# Altium schematic sheet Feedback_Sensors.SchDoc
size A2; SheetNumber: 7; SheetTotal: 16
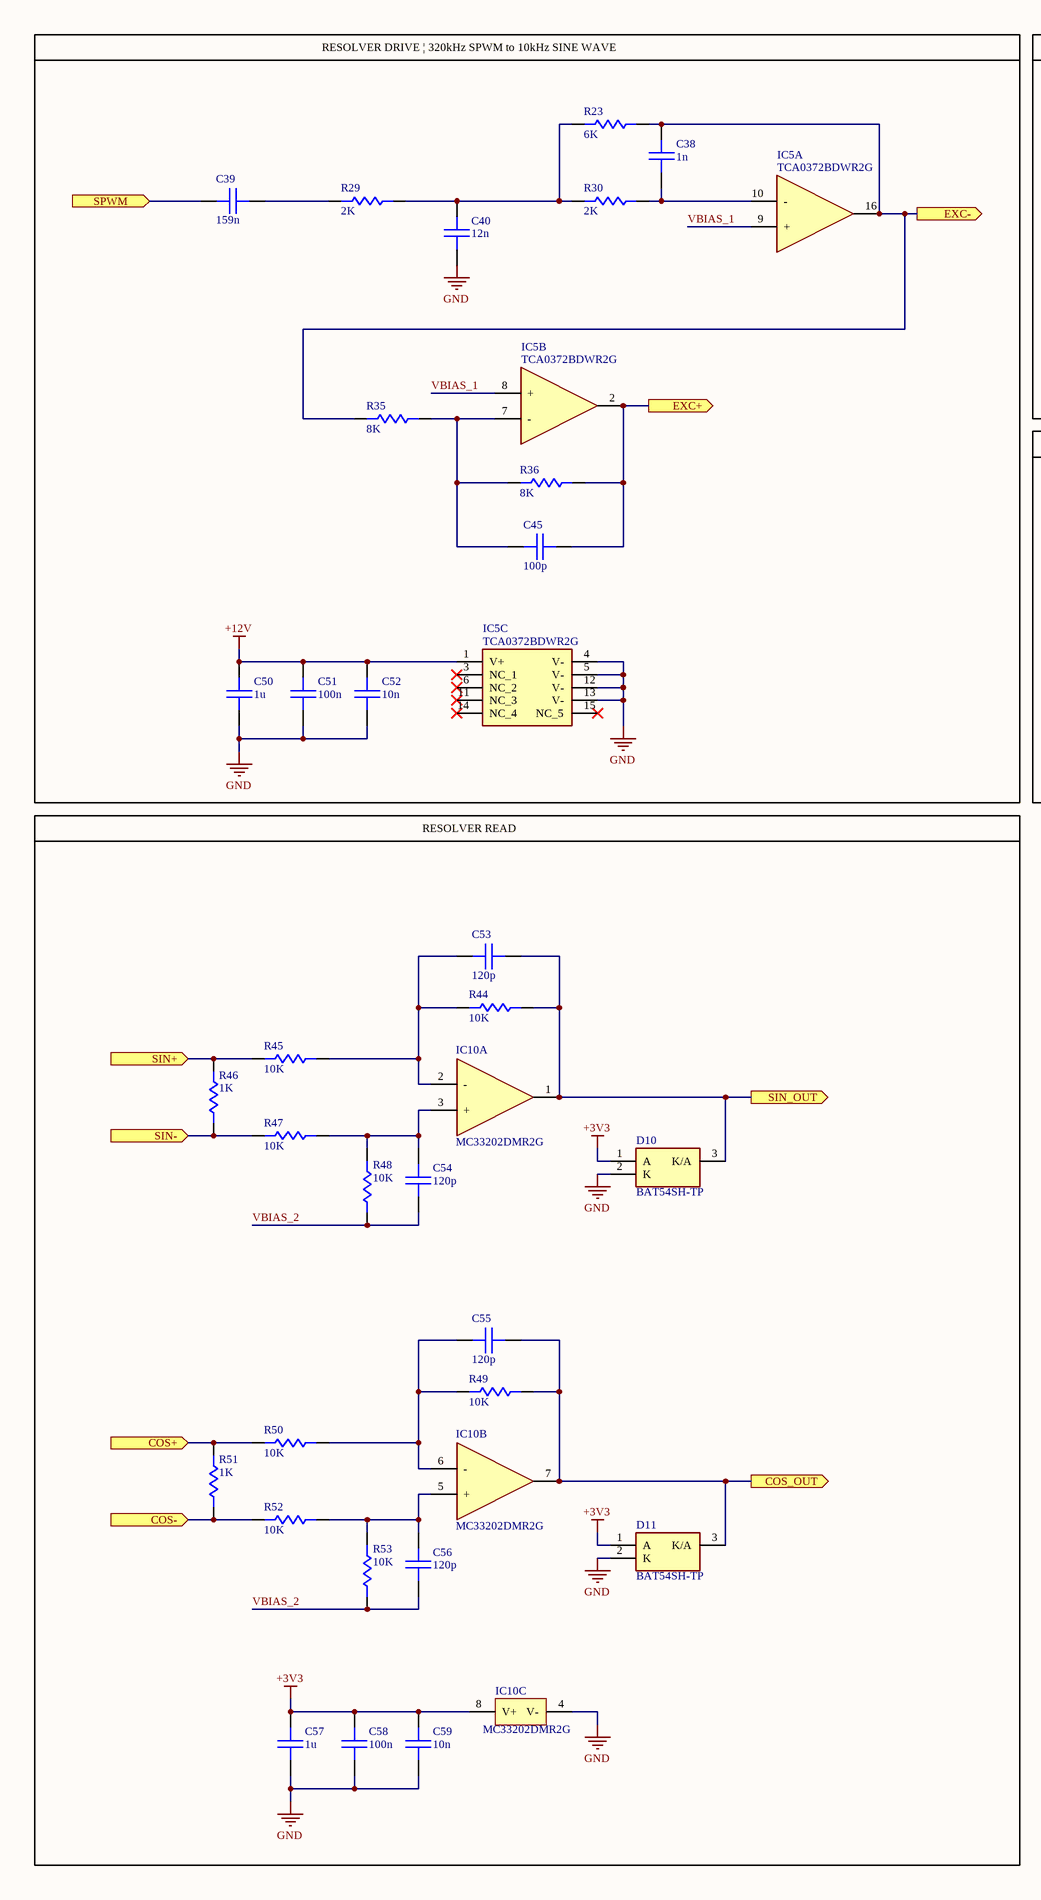
[diagram p0: Feedback_Sensors.SchDoc, left]
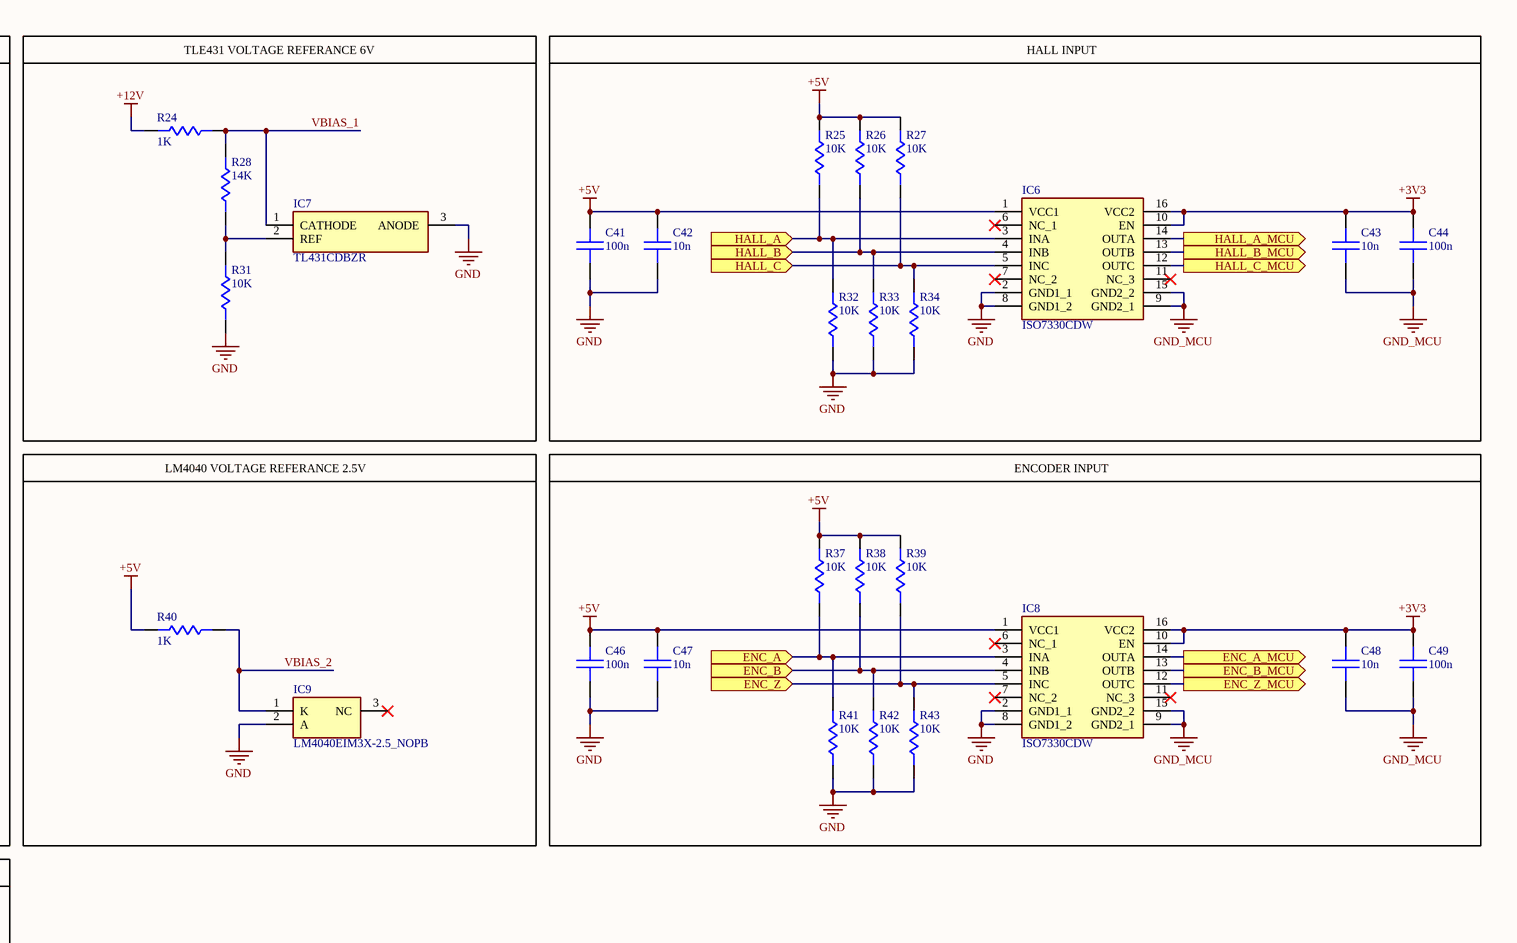
[diagram p1: Feedback_Sensors.SchDoc, right]

## Parts
C38  1n  [C_0603]
C39  159n  [C_0603]
C40  12n  [C_0603]
C41  100n  [C_0603]
C42  10n  [C_0603]
C43  10n  [C_0603]
C44  100n  [C_0603]
C45  100p  [C_0603]
C46  100n  [C_0603]
C47  10n  [C_0603]
C48  10n  [C_0603]
C49  100n  [C_0603]
C50  1u  [C_0603]
C51  100n  [C_0603]
C52  10n  [C_0603]
C53  120p  [C_0603]
C54  120p  [C_0603]
C55  120p  [C_0603]
C56  120p  [C_0603]
C57  1u  [C_0603]
C58  100n  [C_0603]
C59  10n  [C_0603]
D10  BAT54SH-TP  [SOT95P237X125-3N]
D11  BAT54SH-TP  [SOT95P237X125-3N]
IC5  TCA0372BDWR2G  [SOIC127P1030X265-16N]  (parts A,B,C of 3)
IC6  ISO7330CDW  [SOIC127P1030X265-16N]
IC7  TL431CDBZR  [SOT95P237X112-3N]
IC8  ISO7330CDW  [SOIC127P1030X265-16N]
IC9  LM4040EIM3X-2.5_NOPB  [SOT95P237X112-3N]
IC10  MC33202DMR2G  [SOP65P490X110-8N]  (parts A,B,C of 3)
R23  6K  [R_0603]
R24  1K  [R_0603]
R25  10K  [R_0603]
R26  10K  [R_0603]
R27  10K  [R_0603]
R28  14K  [R_0603]
R29  2K  [R_0603]
R30  2K  [R_0603]
R31  10K  [R_0603]
R32  10K  [R_0603]
R33  10K  [R_0603]
R34  10K  [R_0603]
R35  8K  [R_0603]
R36  8K  [R_0603]
R37  10K  [R_0603]
R38  10K  [R_0603]
R39  10K  [R_0603]
R40  1K  [R_0603]
R41  10K  [R_0603]
R42  10K  [R_0603]
R43  10K  [R_0603]
R44  10K  [R_0603]
R45  10K  [R_0603]
R46  1K  [R_0603]
R47  10K  [R_0603]
R48  10K  [R_0603]
R49  10K  [R_0603]
R50  10K  [R_0603]
R51  1K  [R_0603]
R52  10K  [R_0603]
R53  10K  [R_0603]

## Blocks framed on the sheet
RESOLVER DRIVE | 320kHz SPWM to 10kHz SINE WAVE: C38-C40 C45 C50-C52 IC5 R23 R29 R30 R35 R36
TLE431 VOLTAGE REFERANCE 6V: IC7 R24 R28 R31
HALL INPUT: C41-C44 IC6 R25-R27 R32-R34
LM4040 VOLTAGE REFERANCE 2.5V: IC9 R40
ENCODER INPUT: C46-C49 IC8 R37-R39 R41-R43
RESOLVER READ: C53-C59 D10 D11 IC10 R44-R53

## Ports
COS+ (in, see Interconnections[2B], Main_Connector[2B]), COS- (in, see Interconnections[2B], Main_Connector[2B]), COS_OUT (out, see Interconnections[3B], AD_Converter[2C]), ENC_A (in, see Interconnections[2B], Main_Connector[2B]), ENC_A_MCU (out, see Interconnections[3B], Microcontroller[4B]), ENC_B (in, see Interconnections[2B], Main_Connector[2B]), ENC_B_MCU (out, see Interconnections[3B], Microcontroller[4B]), ENC_Z (in, see Interconnections[2B], Main_Connector[2B]), ENC_Z_MCU (out, see Interconnections[3B], Microcontroller[4B]), EXC+ (out, see Interconnections[2B], Main_Connector[2B]), EXC- (out, see Interconnections[2B], Main_Connector[2B]), HALL_A (in, see Interconnections[2B], Main_Connector[2A]), HALL_A_MCU (out, see Interconnections[3B], Microcontroller[4A]), HALL_B (in, see Interconnections[2B], Main_Connector[2A]), HALL_B_MCU (out, see Interconnections[3B], Microcontroller[4B]), HALL_C (in, see Interconnections[2B], Main_Connector[2B]), HALL_C_MCU (out, see Interconnections[3B], Microcontroller[4B]), SIN+ (in, see Interconnections[2B], Main_Connector[2B]), SIN- (in, see Interconnections[2B], Main_Connector[2B]), SIN_OUT (out, see Interconnections[3B], AD_Converter[2B]), SPWM (in, see Interconnections[3B], Isolator_SPWM[2A])

## Nets
+3V3: C43.2 C44.2 C48.2 C49.2 C57.2 C58.2 C59.2 D10.1(A) D11.1(A) IC6.10(EN) IC6.16(VCC2) IC8.10(EN) IC8.16(VCC2) IC10.8(V+)
+5V: C41.2 C42.2 C46.2 C47.2 IC6.1(VCC1) IC8.1(VCC1) R25.1 R26.1 R27.1 R37.1 R38.1 R39.1 R40.2
+12V: C50.2 C51.2 C52.2 IC5.1(V+) R24.2
GND: C40.2 C41.1 C42.1 C46.1 C47.1 C50.1 C51.1 C52.1 C57.1 C58.1 C59.1 D10.2(K) D11.2(K) IC5.4(V-) IC5.5(V-) IC5.12(V-) IC5.13(V-) IC6.2(GND1_1) IC6.8(GND1_2) IC7.3(ANODE) IC8.2(GND1_1) IC8.8(GND1_2) IC9.2(A) IC10.4(V-) R31.1 R32.2 R33.2 R34.2 R41.2 R42.2 R43.2
GND_MCU: C43.1 C44.1 C48.1 C49.1 IC6.9(GND2_1) IC6.15(GND2_2) IC8.9(GND2_1) IC8.15(GND2_2)
COS+: R50.2 R51.2 ; port COS+
COS-: R51.1 R52.2 ; port COS-
COS_OUT: C55.1 D11.3(K/A) IC10.7(OUTPUT_2) R49.1 ; port COS_OUT
ENC_A: IC8.3(INA) R37.2 R41.1 ; port ENC_A
ENC_A_MCU: IC8.14(OUTA) ; port ENC_A_MCU
ENC_B: IC8.4(INB) R38.2 R42.1 ; port ENC_B
ENC_B_MCU: IC8.13(OUTB) ; port ENC_B_MCU
ENC_Z: IC8.5(INC) R39.2 R43.1 ; port ENC_Z
ENC_Z_MCU: IC8.12(OUTC) ; port ENC_Z_MCU
EXC+: C45.1 IC5.2(OUTPUT_B) R36.1 ; port EXC+
EXC-: C38.1 IC5.16(OUTPUT_A) R23.1 R35.2 ; port EXC-
HALL_A: IC6.3(INA) R25.2 R32.1 ; port HALL_A
HALL_A_MCU: IC6.14(OUTA) ; port HALL_A_MCU
HALL_B: IC6.4(INB) R26.2 R33.1 ; port HALL_B
HALL_B_MCU: IC6.13(OUTB) ; port HALL_B_MCU
HALL_C: IC6.5(INC) R27.2 R34.1 ; port HALL_C
HALL_C_MCU: IC6.12(OUTC) ; port HALL_C_MCU
SIN+: R45.2 R46.2 ; port SIN+
SIN-: R46.1 R47.2 ; port SIN-
SIN_OUT: C53.1 D10.3(K/A) IC10.1(OUTPUT_1) R44.1 ; port SIN_OUT
SPWM: C39.1 ; port SPWM
VBIAS_1: IC5.8(+) IC5.9(+) IC7.1(CATHODE) R24.1 R28.2
VBIAS_2: C54.1 C56.1 IC9.1(K) R40.1 R48.1 R53.1
NetC38_2: C38.2 IC5.10(-) R30.1
NetC39_2: C39.2 R29.2
NetC40_1: C40.1 R23.2 R29.1 R30.2
NetC45_2: C45.2 IC5.7(-) R35.1 R36.2
NetC53_2: C53.2 IC10.2(-) R44.2 R45.1
NetC54_2: C54.2 IC10.3(+) R47.1 R48.2
NetC55_2: C55.2 IC10.6(-) R49.2 R50.1
NetC56_2: C56.2 IC10.5(+) R52.1 R53.2
NetIC7_2: IC7.2(REF) R28.1 R31.2

Not connected (* = marked no-connect by the designer): IC5 3(NC_1)* 6(NC_2)* 11(NC_3)* 14(NC_4)* 15(NC_5)*; IC6 6(NC_1)* 7(NC_2)* 11(NC_3)*; IC8 6(NC_1)* 7(NC_2)* 11(NC_3)*; IC9 3(NC)*

## Library data of the parts
C38-C59 = CAP: SMD Chip Capacitor
D10 D11 = BAT54SH-TP: Schottky Diode; Manufacturer_Name: MCC; Datasheet Link: https://www.mccsemi.com/pdf/Products/BAT54H-BAT54SH(SOT-23).pdf; Height: 1.25mm; Manufacturer_Part_Number: BAT54SH-TP
IC5 = TCA0372BDWR2G: Integrated Circuit; Manufacturer_Name: onsemi; Datasheet Link: https://www.onsemi.com/pub/Collateral/TCA0372-D.PDF; Height: 2.65mm; Manufacturer_Part_Number: TCA0372BDWR2G; Mouser Part Number: 863-TCA0372BDWR2G; Mouser Price/Stock: https://www.mouser.co.uk/ProductDetail/onsemi/TCA0372BDWR2G?qs=xZq1yRCsb1cabHbnO0INRw%3D%3D; Arrow Part Number: TCA0372BDWR2G; Arrow Price/Stock: https://www.arrow.com/en/products/tca0372bdwr2g/on-semiconductor?region=nac
IC6 IC8 = ISO7330CDW: Integrated Circuit; Manufacturer_Name: Texas Instruments; Datasheet Link: http://www.ti.com/lit/gpn/iso7330c; Height: 2.65mm; Manufacturer_Part_Number: ISO7330CDW; Mouser Part Number: 595-ISO7330CDW; Mouser Price/Stock: https://www.mouser.co.uk/ProductDetail/Texas-Instruments/ISO7330CDW/?qs=OfeFRKQgECgkB7bvj%252B895A%3D%3D; Arrow Part Number: ISO7330CDW; Arrow Price/Stock: https://www.arrow.com/en/products/iso7330cdw/texas-instruments
IC7 = TL431CDBZR: Integrated Circuit; Manufacturer_Name: Texas Instruments; Datasheet Link: https://www.ti.com/lit/gpn/TL431; Height: 1.12mm; Manufacturer_Part_Number: TL431CDBZR; Mouser Part Number: 595-TL431CDBZR; Mouser Price/Stock: https://www.mouser.co.uk/ProductDetail/Texas-Instruments/TL431CDBZR?qs=odmYgEirbwwSWqcYApoxbg%3D%3D; Arrow Part Number: TL431CDBZR; Arrow Price/Stock: https://www.arrow.com/en/products/tl431cdbzr/texas-instruments?region=nac
IC9 = LM4040EIM3X-2.5_NOPB: Integrated Circuit; Manufacturer_Name: Texas Instruments; Manufacturer_Part_Number: LM4040EIM3X-2.5/NOPB; Datasheet Link: http://www.ti.com/lit/gpn/lm4040-n; Height: 1.12mm; Mouser Part Number: 926-LM4040EIM3X25NPB; Mouser Price/Stock: https://www.mouser.co.uk/ProductDetail/Texas-Instruments/LM4040EIM3X-2.5-NOPB?qs=QbsRYf82W3ECmAFJZbZXfA%3D%3D; Arrow Part Number: LM4040EIM3X-2.5/NOPB; Arrow Price/Stock: https://www.arrow.com/en/products/lm4040eim3x-2.5nopb/texas-instruments?region=nac
IC10 = MC33202DMR2G: Integrated Circuit; Manufacturer_Name: onsemi; Datasheet Link: https://www.onsemi.com/pub/Collateral/MC33201-D.PDF; Height: 1.1mm; Manufacturer_Part_Number: MC33202DMR2G; Mouser Part Number: 863-MC33202DMR2G; Mouser Price/Stock: https://www.mouser.co.uk/ProductDetail/onsemi/MC33202DMR2G?qs=dFKnUM%2FquJa76cgLejLdnw%3D%3D; Arrow Part Number: MC33202DMR2G; Arrow Price/Stock: https://www.arrow.com/en/products/mc33202dmr2g/on-semiconductor?region=nac
R23-R53 = RES: SMD Chip Resistor